# EAGLE design rightboard (EAGLE 9.1.2)
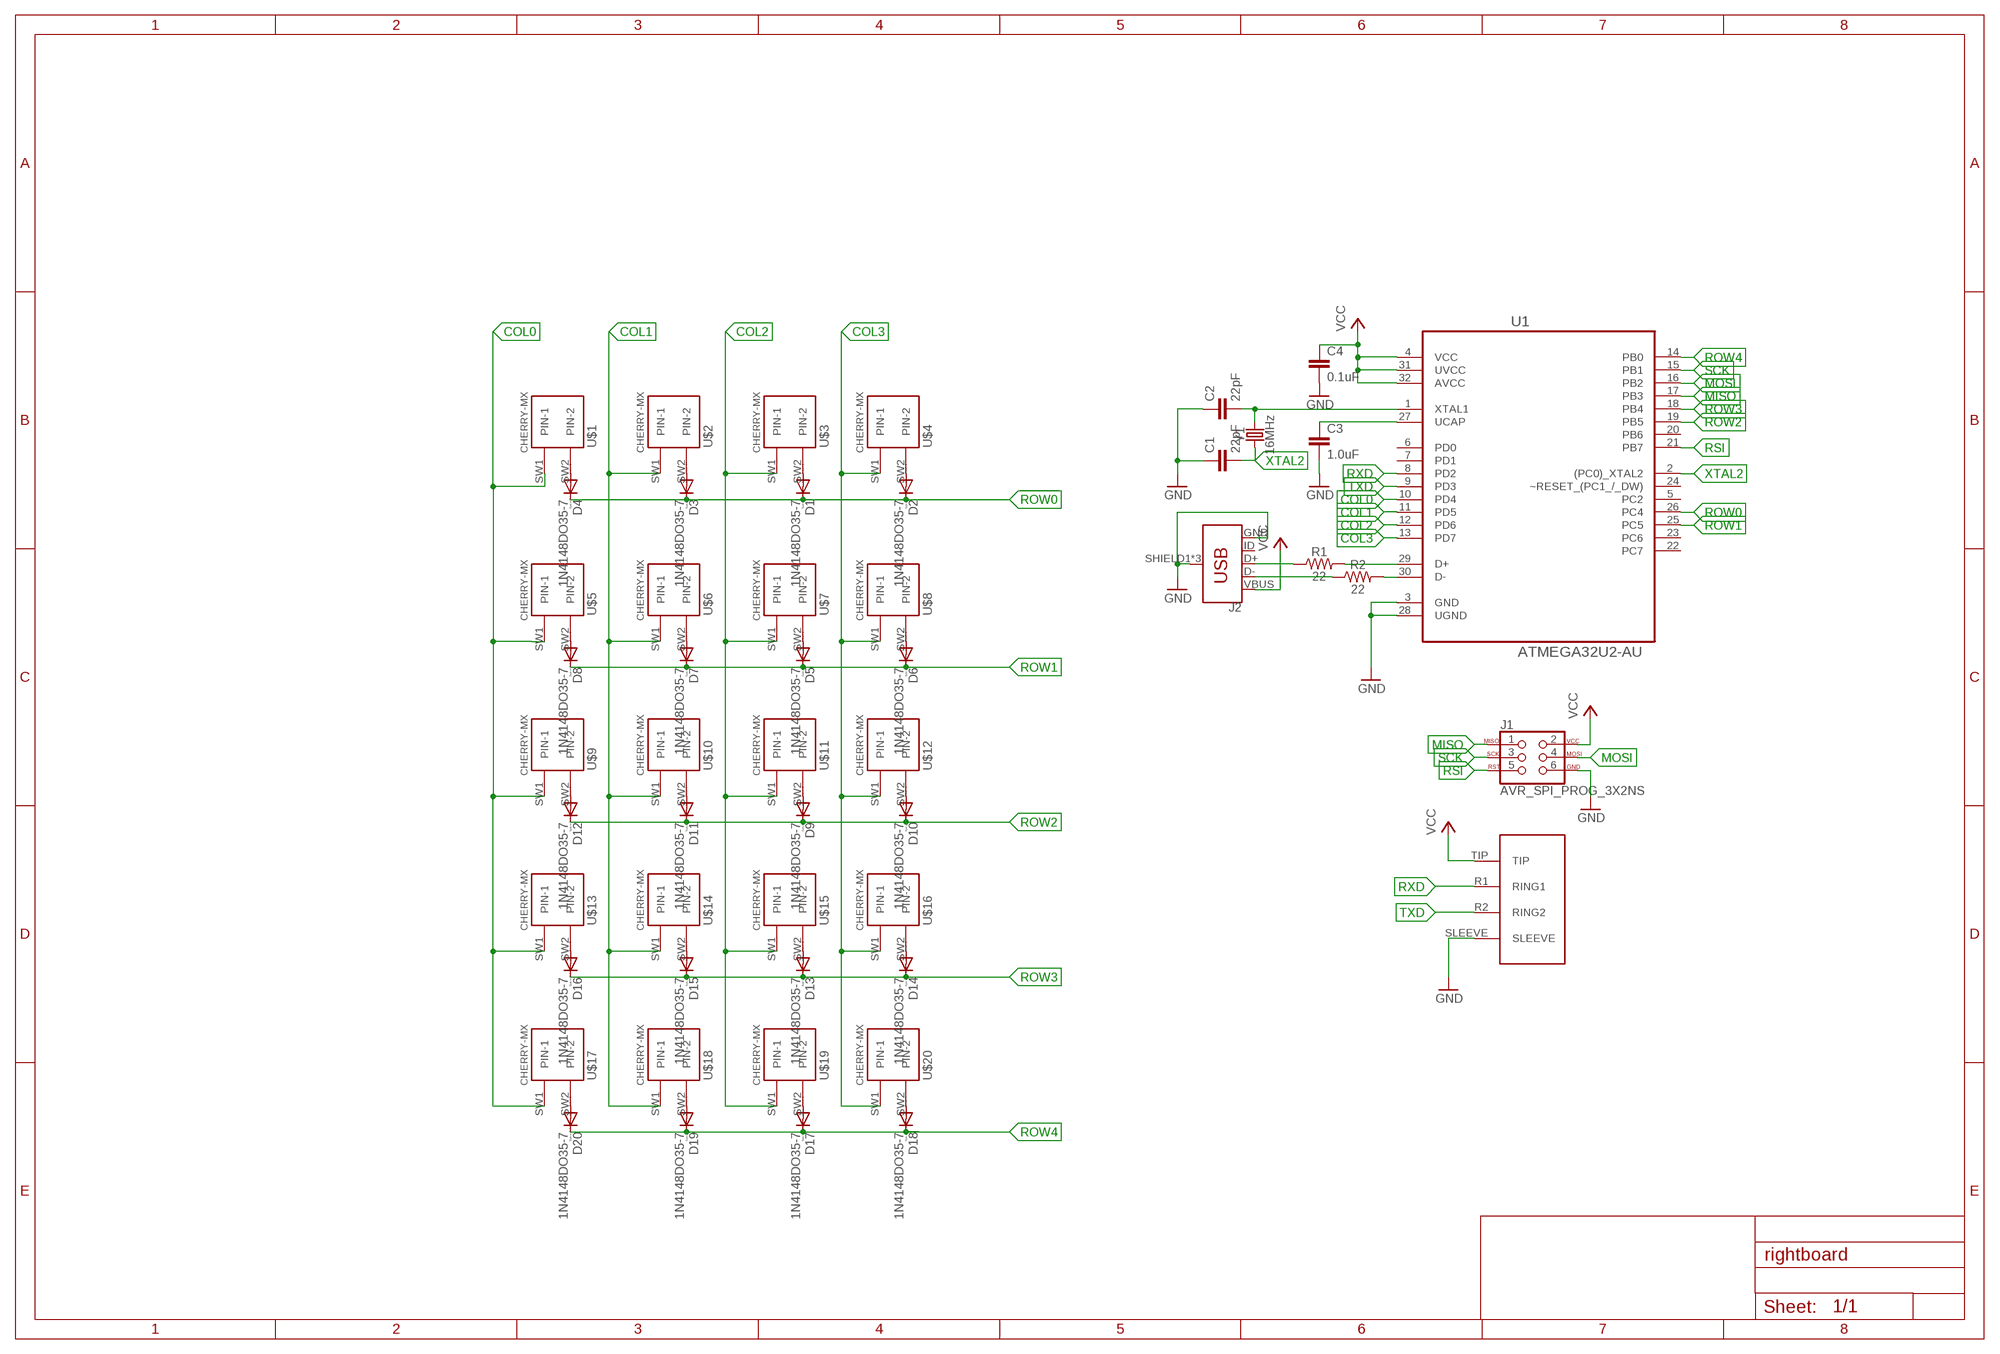
[diagram p0: schematic, sheet 1]

## Parts
C1  22pF  22PF-0603-50V-5%  [0603]
C2  22pF  22PF-0603-50V-5%  [0603]
C3  1.0uF  1.0UF-0603-16V-10%  [0603]
C4  0.1uF  0.1UF-0603-25V-(+80/-20%)  [0603]
D1  1N4148DO35-7  [DO35-7]
D2  1N4148DO35-7  [DO35-7]
D3  1N4148DO35-7  [DO35-7]
D4  1N4148DO35-7  [DO35-7]
D5  1N4148DO35-7  [DO35-7]
D6  1N4148DO35-7  [DO35-7]
D7  1N4148DO35-7  [DO35-7]
D8  1N4148DO35-7  [DO35-7]
D9  1N4148DO35-7  [DO35-7]
D10  1N4148DO35-7  [DO35-7]
D11  1N4148DO35-7  [DO35-7]
D12  1N4148DO35-7  [DO35-7]
D13  1N4148DO35-7  [DO35-7]
D14  1N4148DO35-7  [DO35-7]
D15  1N4148DO35-7  [DO35-7]
D16  1N4148DO35-7  [DO35-7]
D17  1N4148DO35-7  [DO35-7]
D18  1N4148DO35-7  [DO35-7]
D19  1N4148DO35-7  [DO35-7]
D20  1N4148DO35-7  [DO35-7]
J1  AVR_SPI_PROG_3X2NS  [2X3-NS]
J2  USB_MICRO-B_FEMALE-SMT  [USB-B-MICRO-SMD]
R1  22  22OHM-0603-1/10W-1%  [0603]
R2  22  22OHM-0603-1/10W-1%  [0603]
U1  ATMEGA32U2-AU  [QFP80P900X900X120-32N]
U$1  CHERRY-MX  [CHERRY-MX]
U$2  CHERRY-MX  [CHERRY-MX]
U$3  CHERRY-MX  [CHERRY-MX]
U$4  CHERRY-MX  [CHERRY-MX]
U$5  CHERRY-MX  [CHERRY-MX]
U$6  CHERRY-MX  [CHERRY-MX]
U$7  CHERRY-MX  [CHERRY-MX]
U$8  CHERRY-MX  [CHERRY-MX]
U$9  CHERRY-MX  [CHERRY-MX]
U$10  CHERRY-MX  [CHERRY-MX]
U$11  CHERRY-MX  [CHERRY-MX]
U$12  CHERRY-MX  [CHERRY-MX]
U$13  CHERRY-MX  [CHERRY-MX]
U$14  CHERRY-MX  [CHERRY-MX]
U$15  CHERRY-MX  [CHERRY-MX]
U$16  CHERRY-MX  [CHERRY-MX]
U$17  CHERRY-MX  [CHERRY-MX]
U$18  CHERRY-MX  [CHERRY-MX]
U$19  CHERRY-MX  [CHERRY-MX]
U$20  CHERRY-MX  [CHERRY-MX]
U$21  54-00035  [54-00035]
Y1  16MHz  CRYSTAL-16MHZPTH-HC49US  [HC49US]

## Nets
COL0: U1.10(PD4) U$1.SW1(PIN-1) U$5.SW1(PIN-1) U$9.SW1(PIN-1) U$13.SW1(PIN-1) U$17.SW1(PIN-1)
COL1: U1.11(PD5) U$2.SW1(PIN-1) U$6.SW1(PIN-1) U$10.SW1(PIN-1) U$14.SW1(PIN-1) U$18.SW1(PIN-1)
COL2: U1.12(PD6) U$3.SW1(PIN-1) U$7.SW1(PIN-1) U$11.SW1(PIN-1) U$15.SW1(PIN-1) U$19.SW1(PIN-1)
COL3: U1.13(PD7) U$4.SW1(PIN-1) U$8.SW1(PIN-1) U$12.SW1(PIN-1) U$16.SW1(PIN-1) U$20.SW1(PIN-1)
GND: C1.1 C2.1 C3.2 C4.2 J1.6 J2.GND J2.SHIELD1(SHIELD) J2.SHIELD2(SHIELD) J2.SHIELD3(SHIELD) U1.3(GND) U1.28(UGND) U$21.SLEEVE
MISO: J1.1 U1.17(PB3)
MOSI: J1.4 U1.16(PB2)
N$1: D1.A U$3.SW2(PIN-2)
N$2: D2.A U$4.SW2(PIN-2)
N$3: D3.A U$2.SW2(PIN-2)
N$4: D4.A U$1.SW2(PIN-2)
N$5: D5.A U$7.SW2(PIN-2)
N$6: D6.A U$8.SW2(PIN-2)
N$7: D7.A U$6.SW2(PIN-2)
N$8: D8.A U$5.SW2(PIN-2)
N$9: D9.A U$11.SW2(PIN-2)
N$10: D10.A U$12.SW2(PIN-2)
N$11: D11.A U$10.SW2(PIN-2)
N$12: D12.A U$9.SW2(PIN-2)
N$13: D13.A U$15.SW2(PIN-2)
N$14: D14.A U$16.SW2(PIN-2)
N$15: D15.A U$14.SW2(PIN-2)
N$16: D16.A U$13.SW2(PIN-2)
N$17: D17.A U$19.SW2(PIN-2)
N$18: D18.A U$20.SW2(PIN-2)
N$19: D19.A U$18.SW2(PIN-2)
N$20: D20.A U$17.SW2(PIN-2)
N$21: C2.2 U1.1(XTAL1) Y1.2
N$22: R1.2 U1.29(D+)
N$23: J2.D+ R1.1
N$24: J2.D- R2.1
N$25: R2.2 U1.30(D-)
N$27: C3.1 U1.27(UCAP)
ROW0: D1.C D2.C D3.C D4.C U1.26(PC4)
ROW1: D5.C D6.C D7.C D8.C U1.25(PC5)
ROW2: D9.C D10.C D11.C D12.C U1.19(PB5)
ROW3: D13.C D14.C D15.C D16.C U1.18(PB4)
ROW4: D17.C D18.C D19.C D20.C U1.14(PB0)
RSI: J1.5 U1.21(PB7)
RXD: U1.8(PD2) U$21.R1(RING1)
SCK: J1.3 U1.15(PB1)
TXD: U1.9(PD3) U$21.R2(RING2)
VCC: C4.1 J1.2 J2.VBUS U1.4(VCC) U1.31(UVCC) U1.32(AVCC) U$21.TIP
XTAL2: C1.2 U1.2((PC0)_XTAL2) Y1.1
Unconnected: J2.ID U1.5(PC2) U1.6(PD0) U1.7(PD1) U1.20(PB6) U1.22(PC7) U1.23(PC6) U1.24(~RESET_(PC1_/_DW))

## Library data of the parts
C1 C2 = SparkFun-Capacitors:22PF: 22pF ceramic capacitors A capacitor is a passive two-terminal electrical component used to store electrical energy temporarily in an electric field.; PROD_ID: CAP-07876
C3 = SparkFun-Capacitors:1.0UF: 1µF ceramic capacitors A capacitor is a passive two-terminal electrical component used to store electrical energy temporarily in an electric field.; PROD_ID: CAP-00868
C4 = SparkFun-Capacitors:0.1UF: 0.1µF ceramic capacitors A capacitor is a passive two-terminal electrical component used to store electrical energy temporarily in an electric field.; PROD_ID: CAP-00810
D1-D20 = diode:1N4148: DIODE high speed (Philips)
J1 = SparkFun-Connectors:AVR_SPI_PROG_3X2: AVR ISP 6 Pin This is the reduced ISP connector for AVR programming. Common on Arduino. This footprint will take up less PCB space and can be used with a 10-pin to 6-pin adapter such as SKU: BOB-08508 **Special note about "TEST_POINT" package. The stop mask is on the top side, so if you want your programming test points to be on the bottom of your board, make sure to place this package on the bottom side of the board. This also ensure that the orientation to program from the bottom side will be correct. SparkFun Products: SparkFun ISP Pogo Adapter <https://www.sparkfun.com/products/11591> - NS Tiny AVR Programmer <https://www.sparkfun.com/products/11801> -PTH
J2 = SparkFun-Connectors:USB_MICRO-B: USB Type Micro-B Connector Male/female and PTH/SMT variants SparkFun Products: SparkFun microB USB Breakout <https://www.sparkfun.com/products/12035> SparkFun USB microB Plug Breakout <https://www.sparkfun.com/products/10031> SparkFun ESP8266 Thing <https://www.sparkfun.com/products/13231>; PROD_ID: CONN-11752
R1 R2 = SparkFun-Resistors:22OHM: 22Ω resistor A resistor is a passive two-terminal electrical component that implements electrical resistance as a circuit element. Resistors act to reduce current flow, and, at the same time, act to lower voltage levels within circuits. - Wikipedia; PROD_ID: RES-08698
U1 = ATMEGA32U2:ATMEGA32U2-AU: 8-bit Microcontroller with ISP Flash and USB Controller; MPN: ATMEGA32U2-AU; OC_FARNELL: 1748524; OC_NEWARK: 68T2834; PACKAGE: TQFP-32; SUPPLIER: Atmel
U$1-U$20 = cherrymx:CHERRY-MX: Cherry MX series keyswitch
U$21 = mylib:54-00035
Y1 = SparkFun-Clocks:CRYSTAL-16MHZ: 16MHz Crystal Digikey Example <http://www.digikey.com/product-search/en?keywords=535-9122-1-ND> Frequency: 16MHz Frequency Stability: ±50ppm Frequency Tolerance: ±20ppm Load Capacitance: 18pF SparkFun Products: Pro Micro -5V/16MHz <https://www.sparkfun.com/products/12640> SparkFun Serial Enabled LCD Kit <https://www.sparkfun.com/products/10097>; PROD_ID: XTAL-08181; SF_ID: COM-00536

## Board
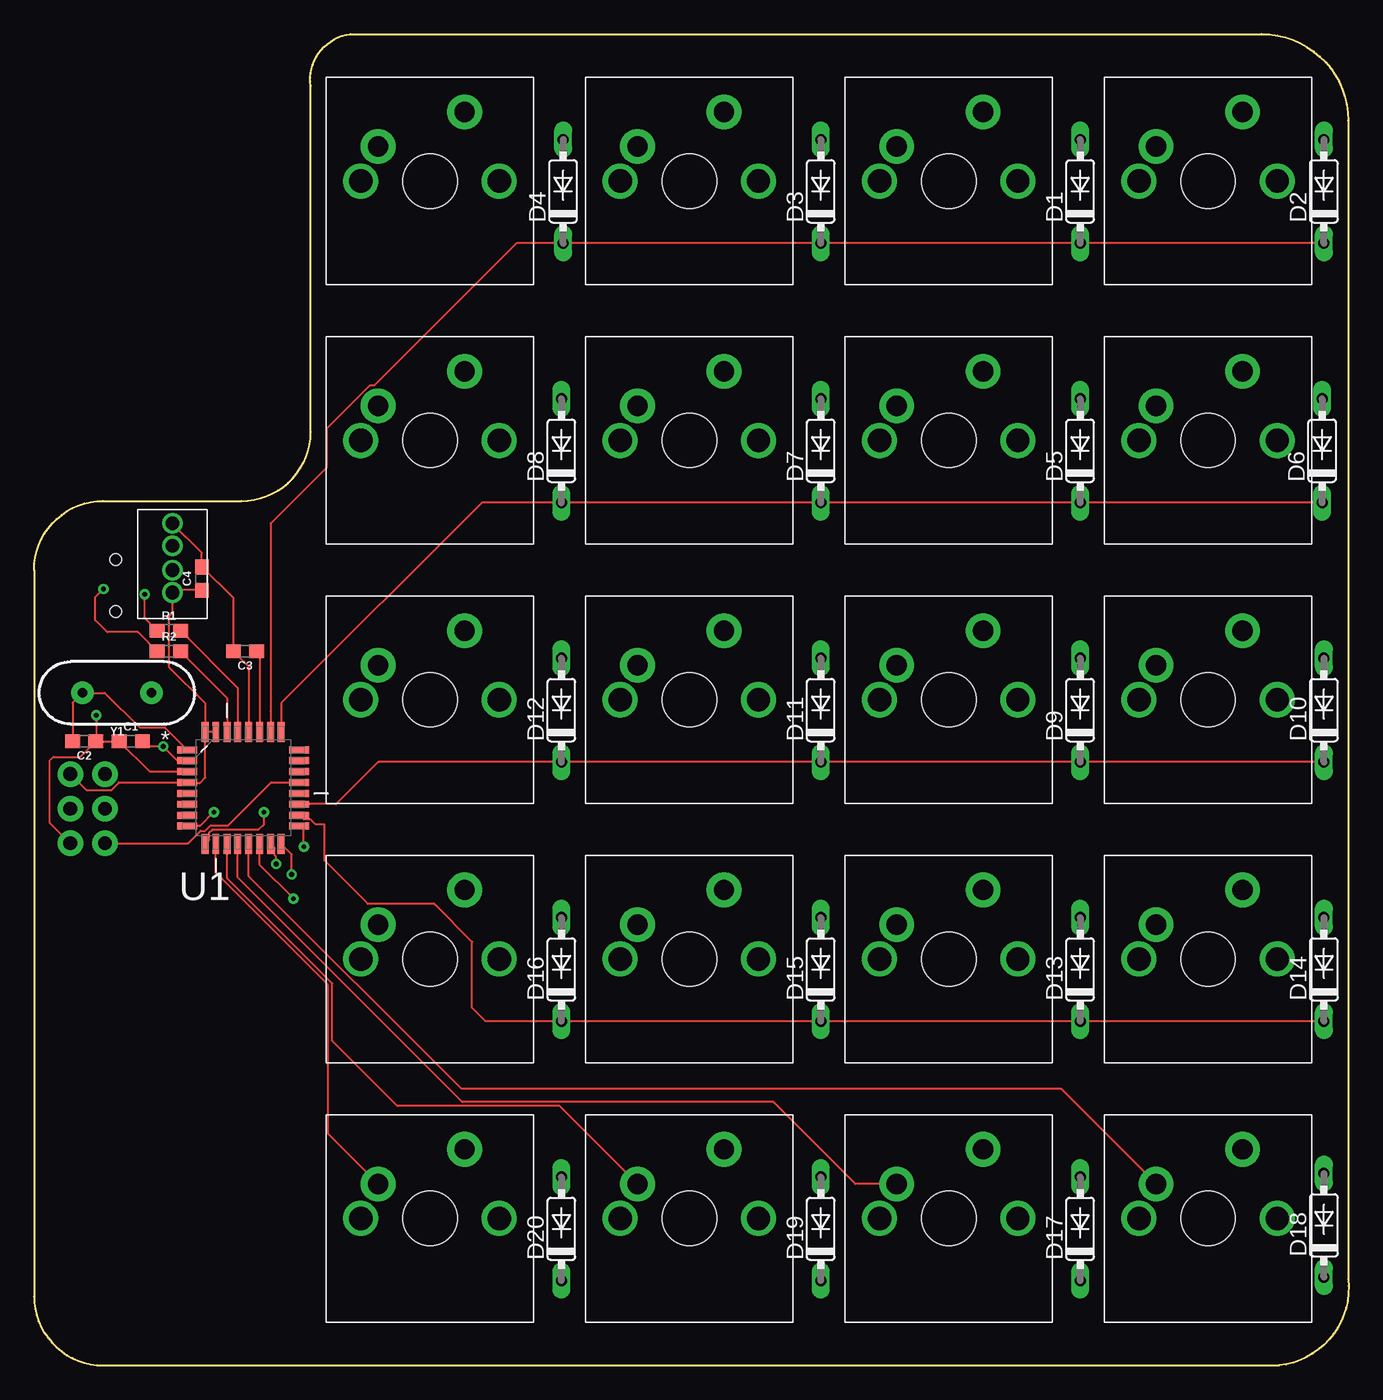
[diagram p1: board, top side]
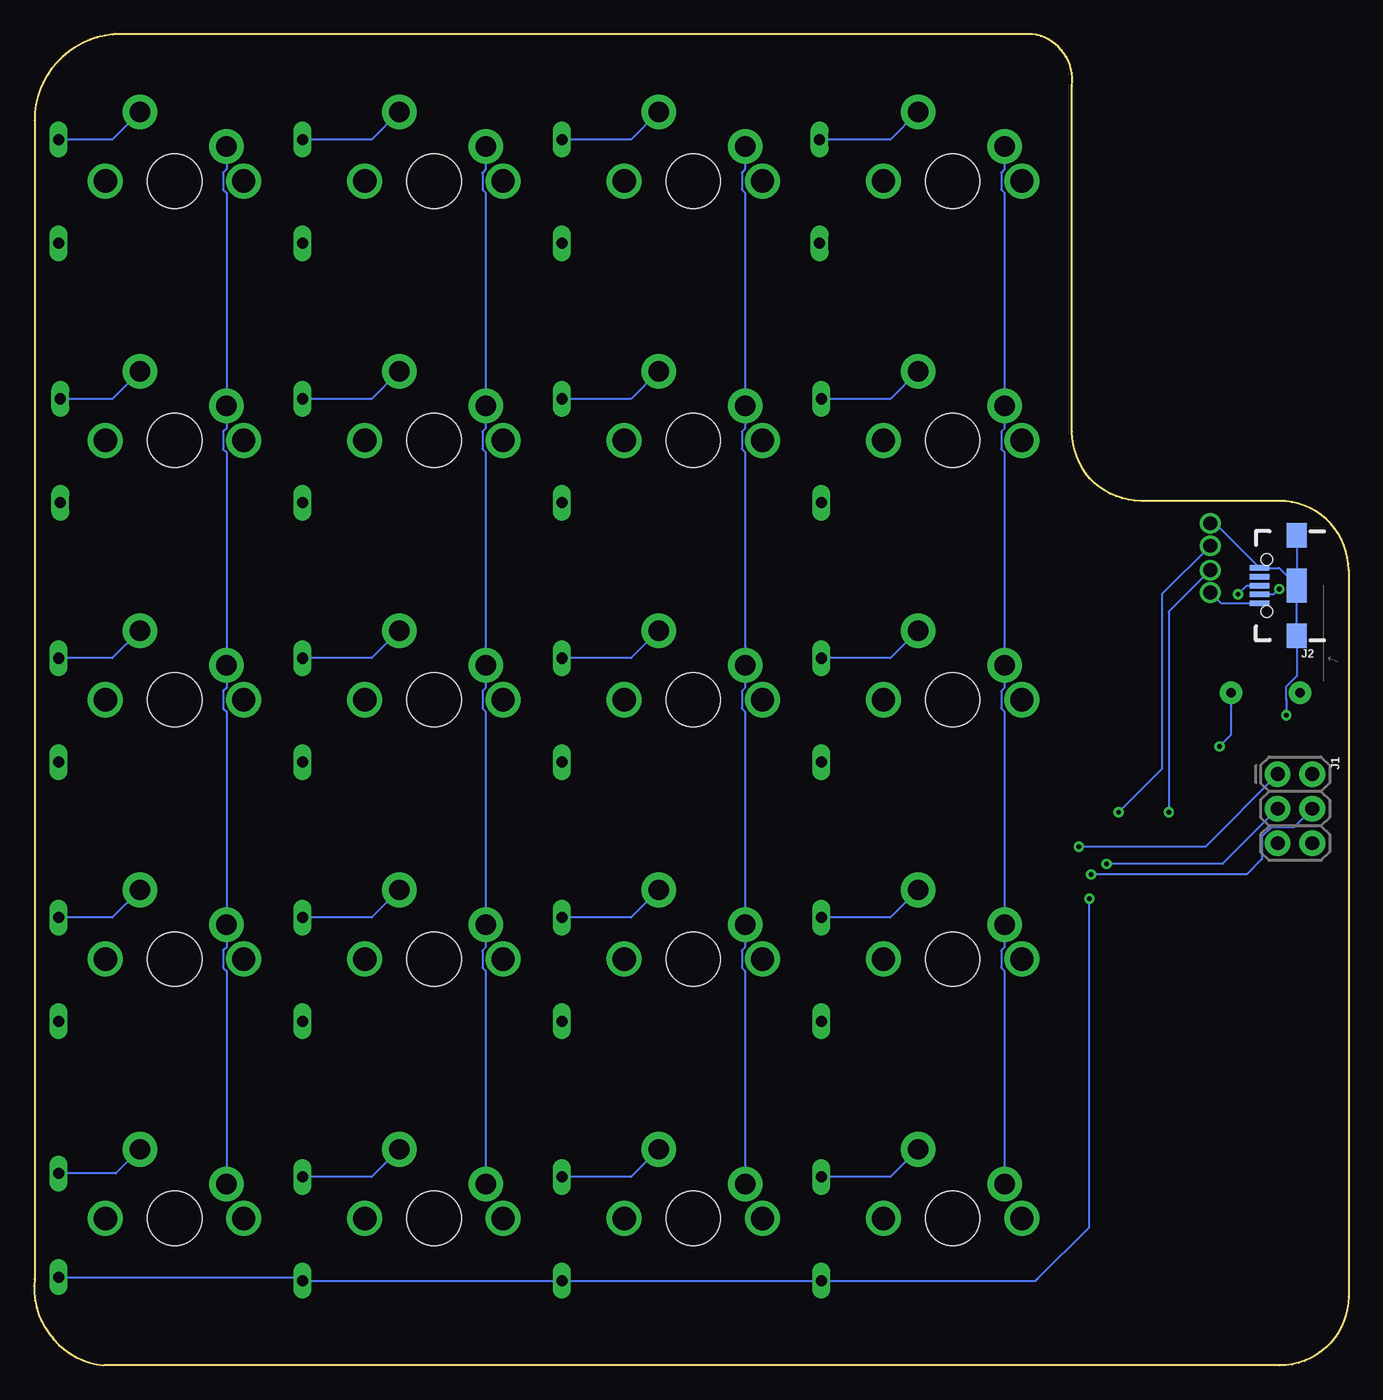
[diagram p2: board, bottom side, seen from below]

Size 96.55 x 97.79 mm. Coordinates in mm from the lower left corner, seen from the top.
Outline: 23.24,97.79 90.17,97.79 arc-90 96.52,91.44 96.52,6.35 arc-90 91.44,0 5.08,0 arc-90 0,5.08 0,58.42 arc-90 5.08,63.5 15.24,63.5 arc90 20.32,68.58 20.32,93.98 arc-90 23.24,97.79
Copper layers (1*16): Top 0.035mm / dielectric 1.5mm / Bottom 0.035mm
Design rules "default": minimum track width 6mil, minimum drill 0.35mm, track to track 6mil, track to pad 6mil, pad to pad 6mil, via to via 6mil, smd to smd 6mil, copper to edge 40mil, drill to drill 6mil, minimum pad ring 10mil, minimum via ring 8mil, stop-mask expansion 4mil, vias tented up to drill 0mil, thermal gap 10mil

### Footprints (pad centres in the part's own frame; a part is rotated, then mirrored left to right if it is on the bottom)
0603 = smd 1.1 x 1: 1 -0.85,0; 2 0.85,0
DO35-7 = drill 0.813 long: A 3.81,0; C -3.81,0
2X3-NS = drill 1.016 pad 1.88: 1 -2.54,-1.27; 2 -2.54,1.27; 3 0,-1.27; 4 0,1.27; 5 2.54,-1.27; 6 2.54,1.27
USB-B-MICRO-SMD = smd 1.45 x 0.4: D+ 2.725,0; D- 2.725,0.65; GND 2.725,-1.3; ID 2.725,-0.65; VBUS 2.725,1.3 | smd 1.5 x 1.8: SHIELD1 0,3.685; SHIELD2 0,-3.685 | smd 1.5 x 2.5: SHIELD3 0,0 | hole 0.85: 2.2,1.9; 2.2,-1.9
QFP80P900X900X120-32N = smd 1.473 x 0.508: 1 -4.115,2.794; 2 -4.115,2.007; 3 -4.115,1.194; 4 -4.115,0.406; 5 -4.115,-0.406; 6 -4.115,-1.194; 7 -4.115,-2.007; 8 -4.115,-2.794; 17 4.115,-2.794; 18 4.115,-2.007; 19 4.115,-1.194; 20 4.115,-0.406; 21 4.115,0.406; 22 4.115,1.194; 23 4.115,2.007; 24 4.115,2.794 | smd 0.508 x 1.473: 9 -2.794,-4.115; 10 -2.007,-4.115; 11 -1.194,-4.115; 12 -0.406,-4.115; 13 0.406,-4.115; 14 1.194,-4.115; 15 2.007,-4.115; 16 2.794,-4.115; 25 2.794,4.115; 26 2.007,4.115; 27 1.194,4.115; 28 0.406,4.115; 29 -0.406,4.115; 30 -1.194,4.115; 31 -2.007,4.115; 32 -2.794,4.115
CHERRY-MX = drill 1.714 pad 1.93: P$3 -5.08,0; P$4 5.08,0 | drill 1.5 pad 2.54: SW1 -3.81,2.54; SW2 2.54,5.08 | hole 4: 0,0
54-00035 = drill 1: R1 3.429,0; R2 1.651,0; SLEEVE 0,0; TIP 5.08,0
HC49US = drill 0.7 pad 1.651: 1 -2.54,0; 2 2.54,0

### Placement (x,y rotation side)
C1  7.11,45.85 0 top
C2  3.68,45.85 180 top
C3  15.49,52.45 180 top
C4  12.32,57.78 90 top
D1  76.83,86.23 90 top
D2  94.74,86.23 90 top
D3  57.78,86.23 90 top
D4  38.86,86.23 90 top
D5  76.83,67.18 90 top
D6  94.61,67.18 90 top
D7  57.78,67.18 90 top
D8  38.73,67.18 90 top
D9  76.83,48.13 90 top
D10  94.74,48.13 90 top
D11  57.78,48.13 90 top
D12  38.73,48.13 90 top
D13  76.83,29.08 90 top
D14  94.74,29.08 90 top
D15  57.78,29.08 90 top
D16  38.73,29.08 90 top
D17  76.83,10.03 90 top
D18  94.74,10.29 90 top
D19  57.78,10.03 90 top
D20  38.73,10.03 90 top
J1  3.94,40.89 270 bottom
J2  3.81,57.28 180 bottom
R1  9.91,53.98 0 top
R2  9.91,52.45 0 top
U1  15.37,42.42 0 top
U$1  29.08,87 0 top
U$2  48.13,87 0 top
U$3  67.18,87 0 top
U$4  86.23,87 0 top
U$5  29.08,67.94 0 top
U$6  48.13,67.94 0 top
U$7  67.18,67.94 0 top
U$8  86.23,67.94 0 top
U$9  29.08,48.9 0 top
U$10  48.13,48.9 0 top
U$11  67.18,48.9 0 top
U$12  86.23,48.9 0 top
U$13  29.08,29.84 0 top
U$14  48.13,29.84 0 top
U$15  67.18,29.84 0 top
U$16  86.23,29.84 0 top
U$17  29.08,10.79 0 top
U$18  48.13,10.79 0 top
U$19  67.18,10.79 0 top
U$20  86.23,10.79 0 top
U$21  10.16,61.85 270 top
Y1  6.1,49.4 180 top

### Tracks (layer width: path | path; a pad name or v marks a point on that pad's centre or on a via)
COL0
  Top 0.152: U$17.SW1 21.59,17.02 21.59,27.94 13.34,36.2 13.34,38.28 U1.10
  Bottom 0.152: U$1.SW1 25.27,87.87 25.52,87.62 25.52,86.37 25.27,86.12 U$5.SW1 25.27,68.82 25.52,68.57 25.52,67.32 25.27,67.07 U$9.SW1 25.27,49.77 25.52,49.52 25.52,48.27 25.27,48.02 U$13.SW1 25.27,30.72 25.52,30.47 25.52,29.22 25.27,28.97 U$17.SW1
COL1
  Top 0.152: U$18.SW1 38.61,19.05 26.67,19.05 21.89,23.82 21.89,28.07 14.17,35.79 U1.11
  Bottom 0.152: U$2.SW1 44.32,87.87 44.57,87.62 44.57,86.37 44.32,86.12 U$6.SW1 44.32,68.82 44.57,68.57 44.57,67.32 44.32,67.07 U$10.SW1 44.32,49.77 44.57,49.52 44.57,48.27 44.32,48.02 U$14.SW1 44.32,30.72 44.57,30.47 44.57,29.22 44.32,28.97 U$18.SW1
COL2
  Top 0.152: U$19.SW1 60.33,13.34 54.3,19.36 31.45,19.36 14.96,35.84 U1.12
  Bottom 0.152: U$3.SW1 63.37,87.87 63.62,87.62 63.62,86.37 63.37,86.12 U$7.SW1 63.37,68.82 63.62,68.57 63.62,67.32 63.37,67.07 U$11.SW1 63.37,49.77 63.62,49.52 63.62,48.27 63.37,48.02 U$15.SW1 63.37,30.72 63.62,30.47 63.62,29.22 63.37,28.97 U$19.SW1
COL3
  Top 0.152: U$20.SW1 75.44,20.32 31.39,20.32 15.77,35.93 U1.13
  Bottom 0.152: U$4.SW1 82.42,87.87 82.67,87.62 82.67,86.37 82.42,86.12 U$8.SW1 82.42,68.82 82.67,68.57 82.67,67.32 82.42,67.07 U$12.SW1 82.42,49.77 82.67,49.52 82.67,48.27 82.42,48.02 U$16.SW1 82.42,30.72 82.67,30.47 82.67,29.22 82.42,28.97 U$20.SW1
GND  (via drill 0.35)
  Top 0.152: U1.28 15.77,51.32 C3.2 14.64,56.35 12.32,58.67 | C4.2 12.32,58.67 | 12.32,58.67 12.32,59.69 U$21.SLEEVE | C2.1 C1.1 8.5,43.61 11.43,43.61 U1.3 | J1.6 1.17,39.85 1.17,44.45 1.42,44.7 3.39,44.7 C2.1 | v4.57,47.75 4.57,45.89 C2.1
  Bottom 0.152: J2.SHIELD3 5.11,58.58 J2.GND 9.81,61.85 U$21.SLEEVE | J2.SHIELD2 J2.SHIELD3 | J2.SHIELD3 J2.SHIELD1 3.81,50.64 4.61,49.84 4.61,48.97 4.57,48.93 v4.57,47.75
MISO  (via drill 0.35)
  Top 0.152: v19.81,38.1 19.81,39.29 U1.17
  Bottom 0.152: J1.1 10.54,38.1 v19.81,38.1
MOSI  (via drill 0.35)
  Top 0.152: v18.92,36.07 18.92,37.54 U1.16
  Bottom 0.152: v18.92,36.07 7.49,36.07 6.38,37.19 6.38,38.84 5.69,39.52 4.04,39.52 J1.4
N$1
  Bottom 0.152: U$3.SW2 71.75,90.04 D1.A
N$2
  Bottom 0.152: U$4.SW2 90.81,90.04 D2.A
N$3
  Bottom 0.152: U$2.SW2 52.7,90.04 D3.A
N$4
  Bottom 0.152: U$1.SW2 33.66,90.04 D4.A
N$5
  Bottom 0.152: U$7.SW2 71.75,70.99 D5.A
N$6
  Bottom 0.152: U$8.SW2 90.81,70.99 D6.A
N$7
  Bottom 0.152: U$6.SW2 52.7,70.99 D7.A
N$8
  Bottom 0.152: U$5.SW2 33.66,70.99 D8.A
N$9
  Bottom 0.152: U$11.SW2 71.75,51.94 D9.A
N$10
  Bottom 0.152: U$12.SW2 90.81,51.94 D10.A
N$11
  Bottom 0.152: U$10.SW2 52.7,51.94 D11.A
N$12
  Bottom 0.152: U$9.SW2 33.66,51.94 D12.A
N$13
  Bottom 0.152: U$15.SW2 71.75,32.89 D13.A
N$14
  Bottom 0.152: U$16.SW2 90.81,32.89 D14.A
N$15
  Bottom 0.152: U$14.SW2 52.7,32.89 D15.A
N$16
  Bottom 0.152: U$13.SW2 33.66,32.89 D16.A
N$17
  Bottom 0.152: U$19.SW2 71.75,13.84 D17.A
N$18
  Bottom 0.152: U$20.SW2 90.55,14.1 D18.A
N$19
  Bottom 0.152: U$18.SW2 52.7,13.84 D19.A
N$20
  Bottom 0.152: U$17.SW2 33.66,13.84 D20.A
N$21
  Top 0.152: C2.2 2.83,48.68 Y1.2 5.21,49.4 7.75,46.86 9.6,46.86 U1.1
N$22
  Top 0.152: R1.2 14.96,49.77 U1.29
N$23  (via drill 0.35)
  Top 0.152: R1.1 8.13,54.9 v8.13,56.64
  Bottom 0.152: v8.13,56.64 7.49,57.28 J2.D+
N$24  (via drill 0.35)
  Top 0.152: R2.1 7.65,53.86 5.38,53.86 4.49,54.75 4.49,56.43 v5.09,57.03
  Bottom 0.152: J2.D- 6.52,56.64 5.48,56.64 v5.09,57.03
N$25
  Top 0.152: U1.30 14.17,49.03 R2.2
N$27
  Top 0.152: C3.1 16.56,52.23 U1.27
ROW0
  Top 0.152: U1.26 17.37,48.04 17.38,48.05 17.38,61.85 21.49,65.96 21.49,68.82 24.65,71.98 24.99,71.98 35.43,82.42 D4.C D3.C D1.C D2.C
ROW1
  Top 0.152: U1.25 18.16,48.64 32.89,63.37 D8.C D7.C D5.C D6.C
ROW2
  Top 0.152: U1.19 22.17,41.22 25.27,44.32 D12.C D11.C D9.C D10.C
ROW3
  Top 0.152: U1.18 19.79,40.11 20.31,40.11 20.67,39.75 21.34,39.75 21.34,37.08 24.54,33.88 29.42,33.88 32.17,31.13 32.17,26.25 33.15,25.27 D16.C D15.C D13.C D14.C
ROW4  (via drill 0.35)
  Top 0.152: v19.05,34.29 16.56,36.78 U1.14
  Bottom 0.152: v19.05,34.29 19.05,10.16 22.86,6.35 22.99,6.22 D20.C D19.C D17.C 77.09,6.48 D18.C
RSI
  Top 0.152: J1.5 11.31,38.35 12.22,39.27 12.58,39.27 12.99,39.67 14.28,39.67 17.42,42.82 U1.21
RXD  (via drill 0.35)
  Top 0.152: v13.21,40.64 12.19,39.62 U1.8
  Bottom 0.152: U$21.R1 13.21,55.37 v13.21,40.64
SCK  (via drill 0.35)
  Top 0.152: v17.78,36.83 17.78,37.37 17.68,37.47 17.68,38 U1.15
  Bottom 0.152: J1.3 9.27,36.83 v17.78,36.83
TXD  (via drill 0.35)
  Top 0.152: U1.9 12.88,38.61 12.88,39.13 13.11,39.37 16.51,39.37 16.89,39.75 v16.89,40.64
  Bottom 0.152: U$21.R2 13.72,56.64 13.72,43.81 v16.89,40.64
VCC
  Top 0.152: C4.1 10.33,56.94 U$21.TIP 10.16,55.24 9.91,54.99 9.91,51.31 12.57,48.64 12.57,46.35 | J1.2 3.83,42.27 5.69,42.27 6.25,42.82 U1.4 11.28,42.8 12.19,42.8 12.57,43.18 12.57,46.35 | U1.31 U1.32 12.57,46.35
  Bottom 0.152: J2.VBUS 9.37,55.98 U$21.TIP
XTAL2  (via drill 0.35)
  Top 0.152: U1.2 10.53,44.42 v9.49,45.47 8.34,45.47 C1.2
  Bottom 0.152: Y1.1 8.64,46.32 v9.49,45.47